# EAGLE design cc1200layoutv.2 (EAGLE 6.4)
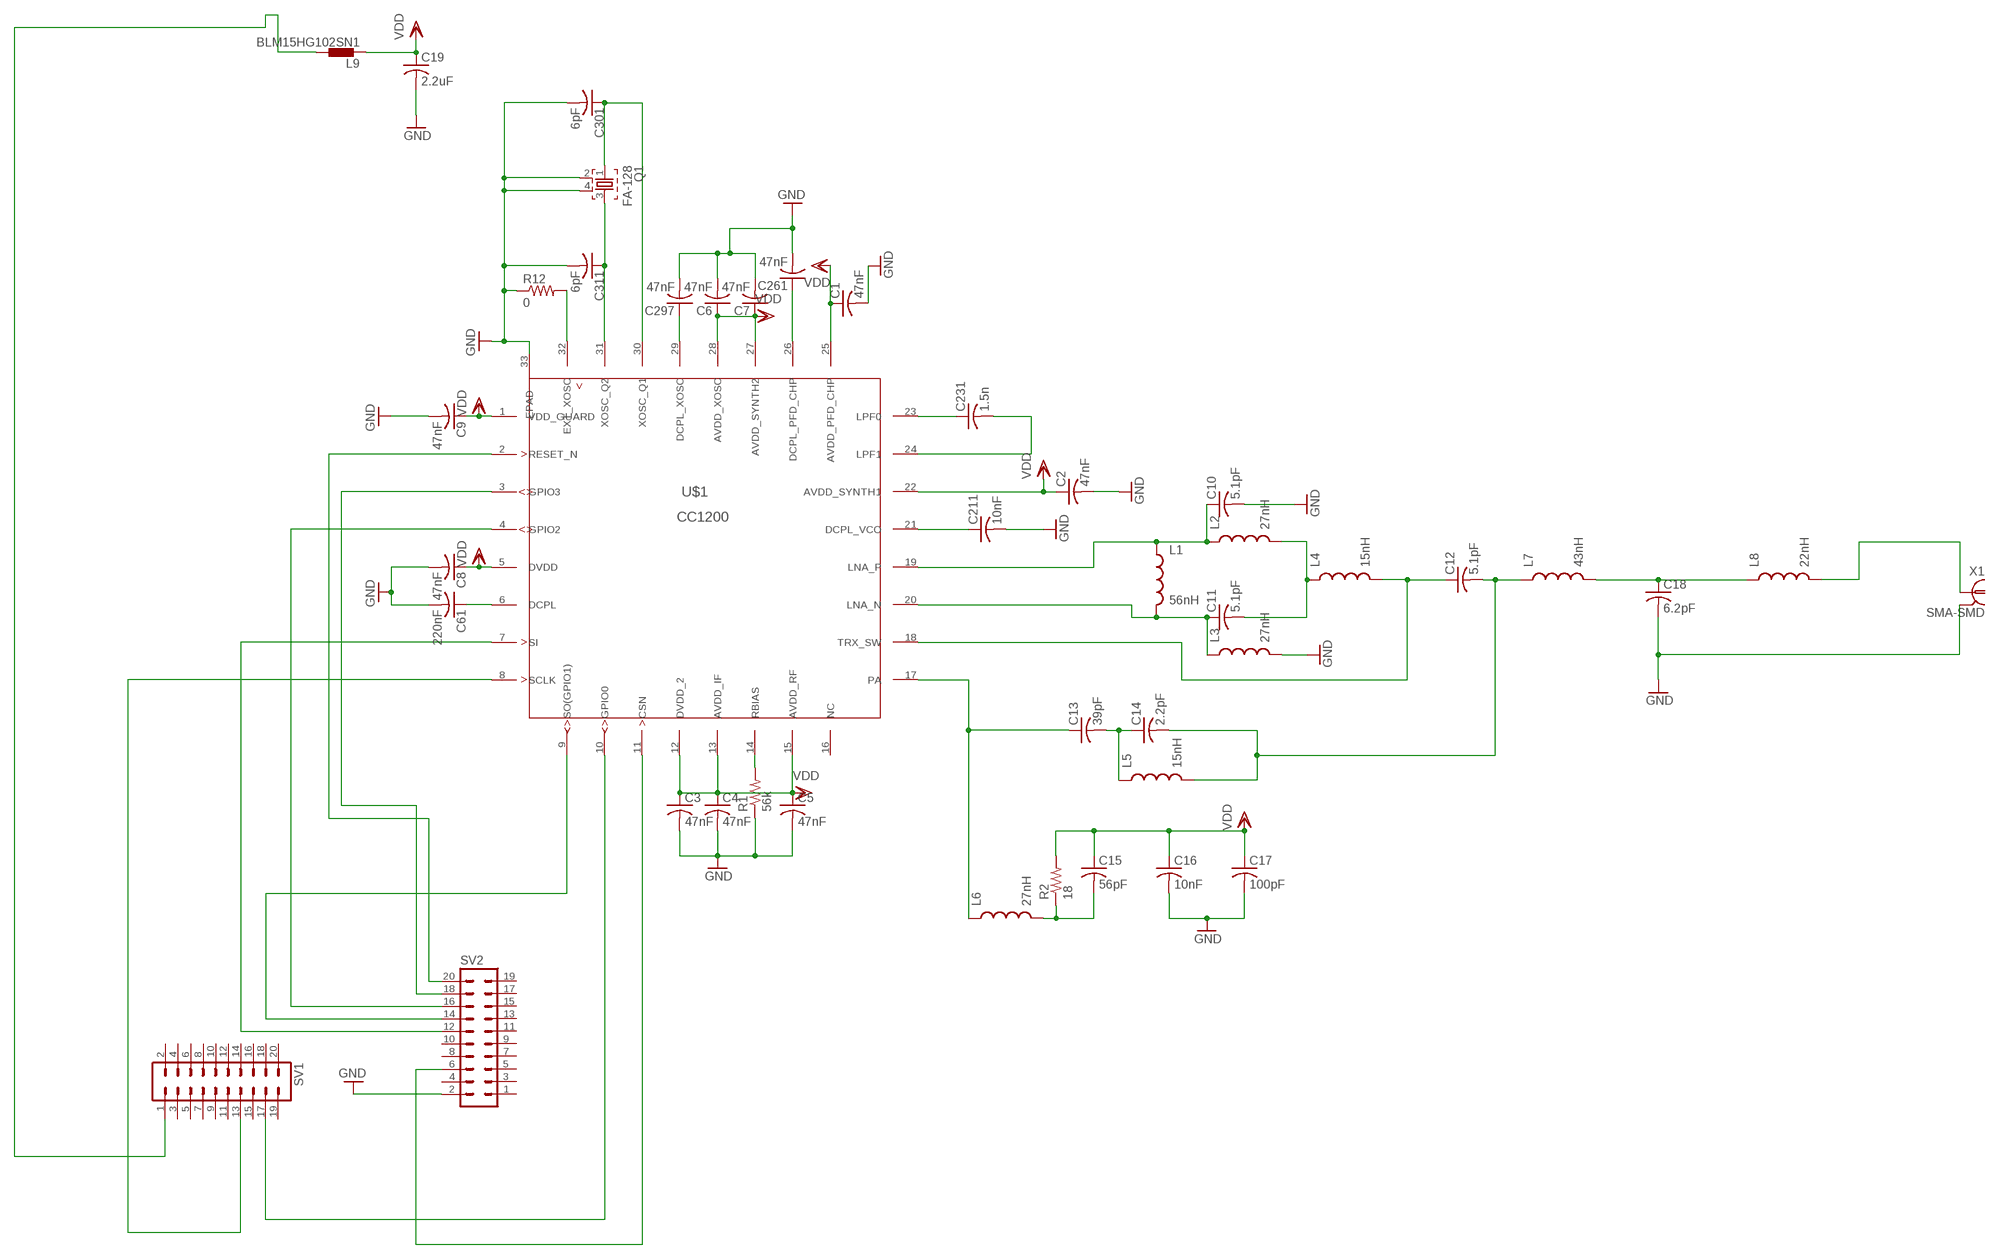
[diagram p0: schematic, sheet 1]

## Parts
C1  47nF  C-USC0402K  [C0402K]
C2  47nF  C-USC0402K  [C0402K]
C3  47nF  C-USC0402K  [C0402K]
C4  47nF  C-USC0402K  [C0402K]
C5  47nF  C-USC0402K  [C0402K]
C6  47nF  C-USC0402K  [C0402K]
C7  47nF  C-USC0402K  [C0402K]
C8  47nF  C-USC0402K  [C0402K]
C9  47nF  C-USC0402K  [C0402K]
C10  5.1pF  C-USC0402K  [C0402K]
C11  5.1pF  C-USC0402K  [C0402K]
C12  5.1pF  C-USC0402K  [C0402K]
C13  39pF  C-USC0402K  [C0402K]
C14  2.2pF  C-USC0402K  [C0402K]
C15  56pF  C-USC0402K  [C0402K]
C16  10nF  C-USC0402K  [C0402K]
C17  100pF  C-USC0402K  [C0402K]
C18  6.2pF  C-USC0402K  [C0402K]
C19  2.2uF  C-USC0603K  [C0603K]
C61  220nF  C-USC0402K  [C0402K]
C211  10nF  C-USC0402K  [C0402K]
C231  1.5n  C-USC0402K  [C0402K]
C261  47nF  C-USC0402K  [C0402K]
C297  47nF  C-USC0402K  [C0402K]
C301  6pF  C-USC0402K  [C0402K]
C311  6pF  C-USC0402K  [C0402K]
L1  56nH  INDUCTOR0402  [C0402]
L2  27nH  INDUCTOR0402  [C0402]
L3  27nH  INDUCTOR0402  [C0402]
L4  15nH  INDUCTOR0402  [C0402]
L5  15nH  INDUCTOR0402  [C0402]
L6  27nH  INDUCTOR0402  [C0402]
L7  43nH  INDUCTOR0402  [C0402]
L8  22nH  INDUCTOR0402  [C0402]
L9  BLM15HG102SN1  [0402]
Q1  FA-128  [FA-128]
R1  56k  R-US_R0402  [R0402]
R2  18  R-US_R0402  [R0402]
R12  0  R-US_R0402  [R0402]
SV1  MA10-2  [MA10-2]
SV2  MA10-2  [MA10-2]
U$1  CC1200  [RHB32_3P45X3P45]
X1  SMA-SMD  [SMA-SMD]

## Nets
GND: C1.2 C2.2 C3.2 C4.2 C5.2 C6.2 C7.2 C8.2 C9.2 C10.2 C16.2 C17.2 C18.2 C19.2 C61.2 C211.2 C261.2 C297.2 C301.2 C311.2 L3.2 Q1.2 Q1.4 R1.1 R12.1 SV2.2 U$1.33(EPAD) X1.2@1 X1.2@2 X1.2@3 X1.2@4 X1.2@5 X1.2@6
N$1: SV2.12 U$1.7(SI)
N$2: SV1.13 U$1.8(SCLK)
N$3: SV2.14 U$1.9(SO(GPIO1))
N$4: SV1.17 U$1.10(GPIO0)
N$5: SV2.6 U$1.11(CSN)
N$6: C231.1 U$1.23(LPF0)
N$7: C231.2 U$1.24(LPF1)
N$8: C211.1 U$1.21(DCPL_VCO)
N$9: C261.1 U$1.26(DCPL_PFD_CHP)
N$10: C297.1 U$1.29(DCPL_XOSC)
N$11: C61.1 U$1.6(DCPL)
N$12: R1.2 U$1.14(RBIAS)
N$13: R12.2 U$1.32(EXT_XOSC)
N$14: C311.1 Q1.3 U$1.31(XOSC_Q2)
N$15: SV2.16 U$1.4(GPIO2)
N$16: SV2.18 U$1.3(GPIO3)
N$17: SV2.20 U$1.2(RESET_N)
N$18: C301.1 Q1.1 U$1.30(XOSC_Q1)
N$19: C10.1 L1.1 L2.1 U$1.19(LNA_P)
N$20: C11.1 L1.2 L3.1 U$1.20(LNA_N)
N$21: L9.2 SV1.1
N$22: C13.1 L6.1 U$1.17(PA)
N$23: C11.2 L2.2 L4.1
N$24: C12.1 L4.2 U$1.18(TRX_SW)
N$25: C13.2 C14.1 L5.1
N$26: C12.2 C14.2 L5.2 L7.1
N$27: C15.2 L6.2 R2.1
N$31: C18.1 L7.2 L8.1
N$32: L8.2 X1.1
VDD: C1.1 C2.1 C3.1 C4.1 C5.1 C6.1 C7.1 C8.1 C9.1 C15.1 C16.1 C17.1 C19.1 L9.1 R2.2 U$1.1(VDD_GUARD) U$1.5(DVDD) U$1.12(DVDD_2) U$1.13(AVDD_IF) U$1.15(AVDD_RF) U$1.22(AVDD_SYNTH1) U$1.25(AVDD_PFD_CHP) U$1.27(AVDD_SYNTH2) U$1.28(AVDD_XOSC)
Unconnected: SV1.2 SV1.3 SV1.4 SV1.5 SV1.6 SV1.7 SV1.8 SV1.9 SV1.10 SV1.11 SV1.12 SV1.14 SV1.15 SV1.16 SV1.18 SV1.19 SV1.20 SV2.1 SV2.3 SV2.4 SV2.5 SV2.7 SV2.8 SV2.9 SV2.10 SV2.11 SV2.13 SV2.15 SV2.17 SV2.19 U$1.16(NC)

## Library data of the parts
C1-C19 C61 C211 C231 C261 C297 C301 C311 = resistor:C-US: CAPACITOR, American symbol
L1-L8 = SparkFun-Passives:INDUCTOR: Inductors Basic Inductor/Choke - 0603 and 1206. Footprints are not proven and vary greatly between part numbers. SRN6045- 33uH, 20% 1.4A SDR0403-560KL - 56uH, 10%, 500mA RMS/740mA peak
L9 = inductors:BLM15H: EMIFIL (R) Chip Ferrite Bead for GHz Noise Source: http://www.murata.com/ Ferrite Bead BLM15H.pdf
Q1 = crystal:FA-: MHz RANGE CRYSTAL UNIT Source: Epson Toyocom
R1 R2 R12 = resistor:R-US_: RESISTOR, American symbol
SV1 SV2 = con-lstb:MA10-2: PIN HEADER; OC_FARNELL: unknown; OC_NEWARK: unknown
U$1 = cc1200:CC1200
X1 = con-coax:SMA-SMD: SMA 50 Ohm Straight Jack Receptacle - Surface Mount www.johnsoncomponents.com Source: http://catalog.digikey.com .. 142-0711-201, 205, 202, 206.pdf; OC_FARNELL: unknown; OC_NEWARK: unknown

## Net classes
0 default: width 0.152 mm, drill 0.33 mm, clearance 0.152 mm

## Board
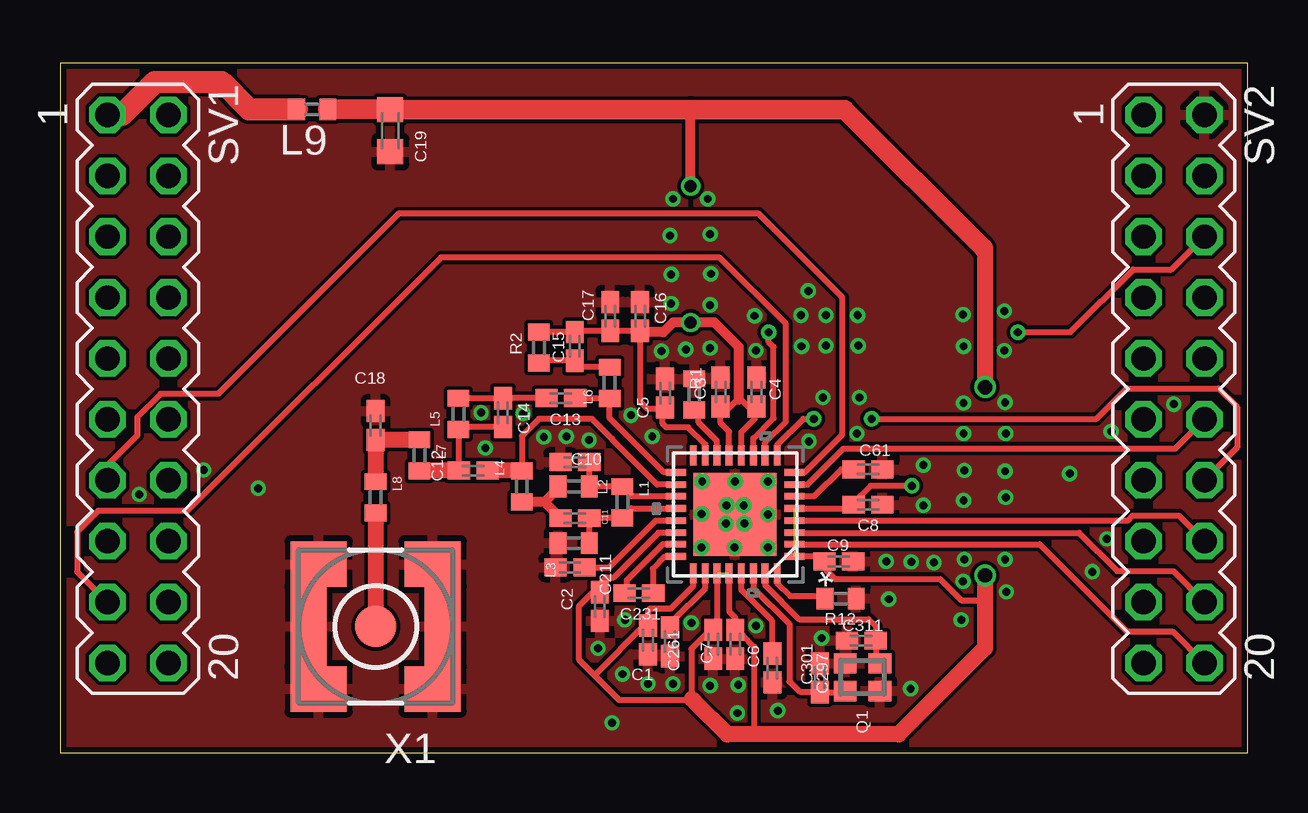
[diagram p1: board, top side]
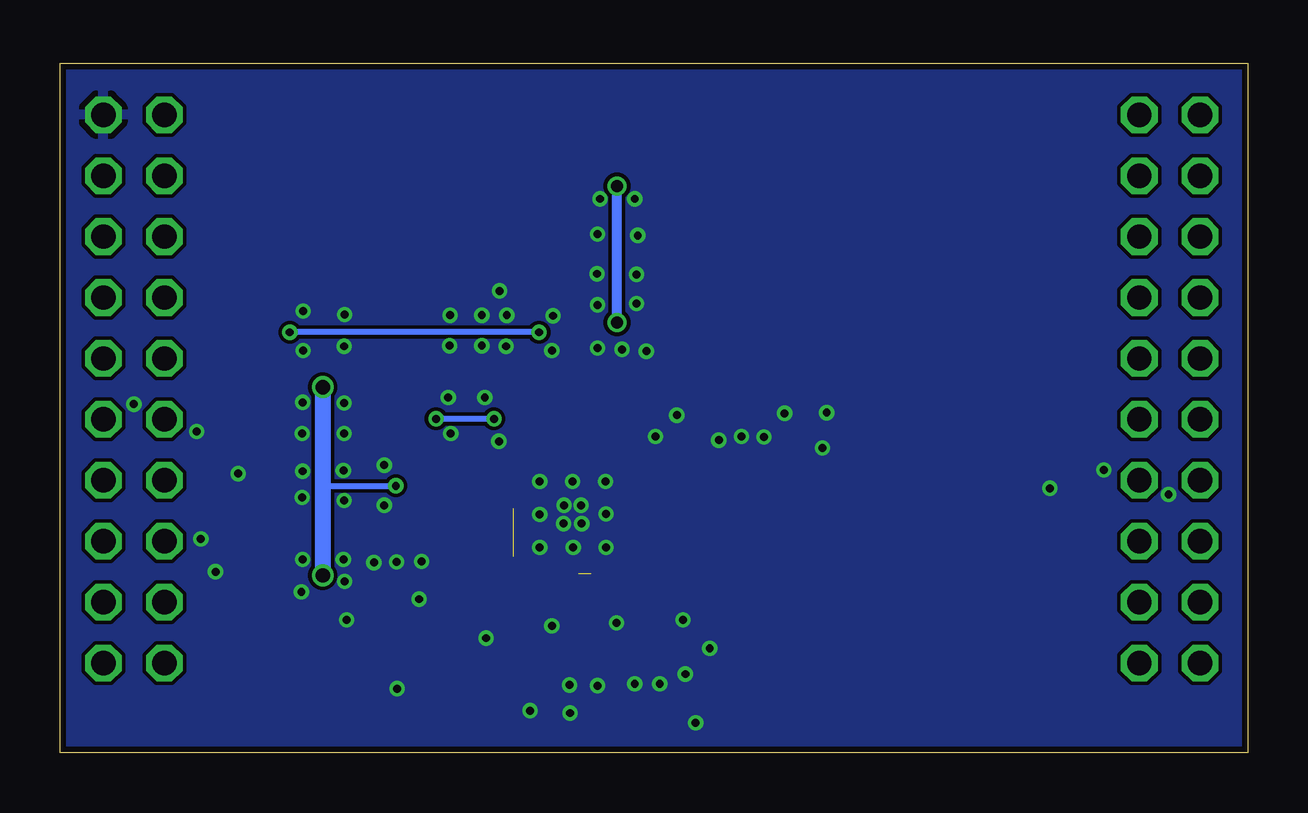
[diagram p2: board, bottom side, seen from below]

Size 49.51 x 28.75 mm. Coordinates in mm from the lower left corner, seen from the top.
Outline: 0,0 49.51,0 49.51,28.75 0,28.75 0,0
Copper layers (1*16): Top 0.035mm / dielectric 1.5mm / Bottom 0.035mm
Design rules "Elecrow_2-layer_eagle_rule": minimum track width 6mil, minimum drill 12mil, track to track 6mil, track to pad 6mil, pad to pad 6mil, via to via 6mil, smd to smd 0mil, copper to edge 10mil, drill to drill 10mil, minimum pad ring 10mil, minimum via ring 6mil, stop-mask expansion 2mil, vias tented up to drill 100mil, thermal gap 10mil

### Footprints (pad centres in the part's own frame; a part is rotated, then mirrored left to right if it is on the bottom)
C0402K = smd 0.925 x 0.74: 1 -0.6,0; 2 0.6,0
C0603K = smd 1.05 x 1.08: 1 -0.875,0; 2 0.875,0
C0402 = smd 0.7 x 0.9: 1 -0.65,0; 2 0.65,0
0402 = smd 0.7 x 0.9: 1 -0.65,0; 2 0.65,0
FA-128 = smd 0.95 x 0.85: 1 -0.725,-0.575; 2 0.725,-0.575; 3 0.725,0.575; 4 -0.725,0.575
R0402 = smd 0.7 x 0.9: 1 -0.65,0; 2 0.65,0
MA10-2 = drill 1.016 octagon: 1 -11.43,-1.27; 2 -11.43,1.27; 3 -8.89,-1.27; 4 -8.89,1.27; 5 -6.35,-1.27; 6 -6.35,1.27; 7 -3.81,-1.27; 8 -3.81,1.27; 9 -1.27,-1.27; 10 -1.27,1.27; 11 1.27,-1.27; 12 1.27,1.27; 13 3.81,-1.27; 14 3.81,1.27; 15 6.35,-1.27; 16 6.35,1.27; 17 8.89,-1.27; 18 8.89,1.27; 19 11.43,-1.27; 20 11.43,1.27
RHB32_3P45X3P45 = smd 0.838 x 0.279: 1 -2.464,1.753; 2 -2.464,1.245; 3 -2.464,0.762; 4 -2.464,0.254; 5 -2.464,-0.254; 6 -2.464,-0.762; 7 -2.464,-1.245; 8 -2.464,-1.753; 17 2.464,-1.753; 18 2.464,-1.245; 19 2.464,-0.762; 20 2.464,-0.254; 21 2.464,0.254; 22 2.464,0.762; 23 2.464,1.245; 24 2.464,1.753 | smd 0.279 x 0.838: 9 -1.753,-2.464; 10 -1.245,-2.464; 11 -0.762,-2.464; 12 -0.254,-2.464; 13 0.254,-2.464; 14 0.762,-2.464; 15 1.245,-2.464; 16 1.753,-2.464; 25 1.753,2.464; 26 1.245,2.464; 27 0.762,2.464; 28 0.254,2.464; 29 -0.254,2.464; 30 -0.762,2.464; 31 -1.245,2.464; 32 -1.753,2.464 | smd 3.454 x 3.454: 33 0,0
SMA-SMD = smd 1.73 x 1.73: 1 0,0 | smd 2.35 x 1.9: 2@1 -2.375,2.6; 2@2 -2.375,-2.6; 2@3 2.375,-2.6; 2@4 2.375,2.6 | smd 1.5 x 3.4: 2@5 -2.8,0; 2@6 2.8,0

### Placement (x,y rotation side)
C1  24.51,4.7 270 top
C2  22.5,6.1 270 top
C3  27.53,15.04 90 top
C4  29.03,15.04 90 top
C5  25.22,14.99 90 top
C6  28.14,4.52 270 top
C7  27.23,4.52 270 top
C8  33.68,10.34 0 top
C9  32.46,7.98 0 top
C10  21.46,12.12 180 top
C11  21.46,9.78 180 top
C12  17.22,11.76 180 top
C13  20.88,14.78 180 top
C14  18.47,14.17 270 top
C15  21.46,16.94 270 top
C16  24.18,18.19 90 top
C17  22.94,18.19 90 top
C18  13.16,13.64 90 top
C19  13.77,25.93 270 top
C61  33.68,11.81 0 top
C211  21.26,7.72 180 top
C231  24.13,6.65 0 top
C261  25.43,4.62 270 top
C297  29.69,3.53 270 top
C301  31.67,3.12 90 top
C311  33.4,4.67 180 top
L1  23.44,10.44 270 top
L2  21.41,11.1 180 top
L3  21.41,8.74 180 top
L4  19.25,11.1 90 top
L5  16.61,14.12 270 top
L6  22.91,15.42 90 top
L7  14.99,12.4 90 top
L8  13.16,10.64 270 top
L9  10.52,26.82 180 top
Q1  33.45,3.15 0 top
R1  26.44,14.94 270 top
R2  19.96,16.89 90 top
R12  32.54,6.43 180 top
SV1  3.25,15.16 270 top
SV2  46.43,15.16 270 top
U$1  28.14,9.93 180 top
X1  13.16,5.26 180 top

### Tracks (layer width: path | path; a pad name or v marks a point on that pad's centre or on a via)
GND  (via drill 0.33)
  other vias: 26.77,11.3 28.12,8.56 29.51,8.56 26.75,8.56 28.14,11.3 26.75,9.96 29.51,9.93 28.5,10.31 28.52,9.55 27.79,10.31 27.76,9.55 29.51,11.3 31.75,4.78 29.01,5.28 26.31,5.41 24.69,13.18 20.17,13.16 21.11,13.18 22.05,13.03 31.19,19.25 8.26,11.02 43.03,7.54 43.64,8.92 25.07,16.74 26.09,16.81 27.1,16.87 42.09,11.63 29.01,16.76 43.81,13.39 31.22,12.98 17.73,12.7 17.55,14.17 19.3,14.15 34.44,7.98 27.1,2.79 28.27,2.82 28.24,1.65 29.92,1.75 34.54,6.4 37.57,5.54 35.46,2.67 23.55,5.54 22.43,4.34 23.44,3.28 25.55,2.87 24.51,2.87 31.8,14.81 33.32,14.81 33.22,13.31 37.67,14.58 37.67,13.31 39.42,13.31 39.4,14.61 37.69,11.76 39.4,11.73 37.67,10.52 39.42,10.64 39.4,8.05 37.69,8.05 36.42,7.92 35.48,7.95 39.45,6.71 3.3,10.77 25.48,18.72 25.48,19.94 27.13,19.96 27.1,18.67 23.8,14.07 25.43,21.56 27.1,21.62 27,23.09 25.55,23.09 30.89,18.24 31.93,18.24 31.93,16.97 30.91,16.94 33.25,18.24 33.27,16.97 37.64,18.26 37.67,16.94 39.37,16.76 39.37,18.41 23.01,1.24 46.43,14.53 28.96,18.21 37.64,7.14 5.99,11.79 35.99,11.99 35.99,10.31
  pour Top: -2.54,55.85 54.61,55.85 54.61,-3.84 -2.54,-3.84
  pour Bottom: -3.81,59.66 55.88,59.66 55.88,-2.57 -3.81,-2.57
N$1
  Top 0.254: U$1.7 31.17,11.18 32.66,12.67 46.48,12.67 SV2.12
N$2
  Top 0.254: U$1.8 31.04,11.68 32.61,13.26 32.61,18.97 29.11,22.48 14.12,22.48 6.6,14.96 4.19,14.96 3.23,14 3.23,13.23 1.98,11.99 SV1.13
N$3  (via drill 0.33)
  Top 0.254: SV2.14 49.07,12.73 49.07,14.4 48.28,15.19 44.48,15.19 43.2,13.92 v33.83,13.92 | U$1.9 29.9,12.83 30.99,13.92 v31.42,13.92
  Bottom 0.254: v31.42,13.92 v33.83,13.92
N$4
  Top 0.254: U$1.10 29.39,12.93 30.25,13.79 30.25,17.88 27.48,20.65 15.88,20.65 5.31,10.08 1.6,10.08 0.71,9.19 0.71,7.54 SV1.17
N$5  (via drill 0.33)
  Top 0.254: U$1.11 28.91,13.11 29.74,13.94 29.74,16.92 29.54,17.12 v29.54,17.53 | v39.93,17.53 42.11,17.53 44.73,20.14 46.33,20.14 SV2.6
  Bottom 0.254: v29.54,17.53 v39.93,17.53
N$6
  Top 0.254: 23.55,6.7 C231.1 23.62,6.75 23.62,7.19 25.12,8.69 U$1.23
N$7
  Top 0.254: U$1.24 25.22,8.18 24.71,7.67 24.71,6.67 C231.2
N$8
  Top 0.254: C211.1 22.89,7.72 24.84,9.68 U$1.21
N$9
  Top 0.254: C261.1 25.53,5.49 26.9,6.86 U$1.26
N$10
  Top 0.254: U$1.29 28.4,6.78 29.67,5.51 29.67,4.16 C297.1
N$11
  Top 0.254: U$1.6 31.45,10.69 32.56,11.81 C61.1
N$12
  Top 0.254: U$1.14 27.38,13 26.62,13.77 26.62,14.11 R1.2
N$13
  Top 0.254: U$1.32 29.9,7.06 30.43,6.53 31.79,6.53 R12.2
N$14
  Top 0.254: Q1.3 34,3.9 C311.1 34.01,4.68 34.01,5.26 33.71,5.56 30.81,5.56 29.39,6.98 U$1.31
N$15
  Top 0.254: U$1.4 44.5,9.68 44.7,9.88 46.63,9.88 SV2.16
N$16
  Top 0.254: U$1.3 42.47,9.17 44.07,7.57 46.41,7.57 SV2.18
N$17
  Top 0.254: U$1.2 40.84,8.69 44.48,5.05 46.38,5.05 SV2.20
N$18
  Top 0.254: Q1.1 32.68,2.52 C301.1 31.66,2.54 30.84,2.54 30.4,2.97 30.4,5.36 28.91,6.86 U$1.30
N$19
  Top 0.254: U$1.19 23.82,10.69 L1.1 23.41,11.1 L2.1 C10.1
N$20
  Top 0.254: U$1.20 23.82,10.19 L1.2 23.41,9.78 C11.1 L3.1
N$21
  Top 0.914: SV1.1 2.59,26.59 3.96,27.97 6.73,27.97 7.87,26.82 L9.2
N$22
  Top 0.254: U$1.17 25.17,11.68 22.91,13.94 L6.1 22.9,14.78 C13.1
N$23
  Top 0.406: C11.2 20.19,10.45 | 20.19,10.45 L4.1 | 20.19,10.45 20.76,11.02 L2.2
N$24
  Top 0.254: U$1.18 24.89,11.18 23.01,13.06 23.01,13.08 22.17,13.92 19.96,13.92 19.25,13.21 L4.2
  Top 0.66: L4.2 C12.1
N$25
  Top 0.254: C13.2 C14.1 L5.1
N$26
  Top 0.254: C14.2 16.71,13.57 L5.2 C12.2
  Top 0.66: C12.2 16.64,11.74 | C12.2 15.01,11.77 L7.1
N$27
  Top 0.254: L6.2 21.74,16.07 C15.2 20.07,16.34 R2.1
N$31
  Top 0.66: L7.2 C18.1 L8.1
N$32
  Top 0.66: L8.2 X1.1
VDD  (via drill 0.33, 0.5, 0.6)  (2 unrouted)
  Top 0.254: U$1.25 26.39,6.93 25.45,5.99 24.59,5.99 24.51,5.92 C1.1 24.49,5.32 24.49,5.38 24.43,5.38 22.3,3.25 22.25,3.25 | 27.38,5.32 C7.1 | U$1.28 27.89,5.89 28.14,5.64 C6.1 28.25,5.02 28.25,4.9 28.45,4.9 28.93,4.42 28.93,0.81 | U$1.27 27.38,5.27 C7.1 | U$1.13 27.89,13.39 27.53,13.74 C3.1 27.64,14.33 27.84,14.33 28.22,14.71 28.3,14.71 28.4,14.71 28.78,14.33 28.92,14.33 C4.1 28.96,14.36 28.96,13.92 28.4,13.36 U$1.12 | U$1.15 26.9,12.85 26.19,13.56 25.27,13.56 25.12,13.72 25.12,14.28 C5.1 25.19,14.35 24.46,14.35 24.18,14.63 24.18,17.53 C16.1 C17.1 21.51,17.59 C15.1 R2.2 | U$1.22 24.94,9.17 23.09,7.32 22.76,7.32 22.5,7.06 C2.1 22.44,6.7 22.33,6.81 21.64,6.12 21.64,3.86 22.25,3.25 | U$1.5 32.93,10.19 C8.1 33.05,10.34 33.02,10.36 33.78,11.13 v35.51,11.13 | 26.34,2.24 26.31,2.26 26.31,4.32 26.92,4.93 27,4.93 27.19,5.12 C7.1 | U$1.1 31.66,8.18 C9.1 31.95,7.88 31.95,7.59 32.31,7.24 36.68,7.24 37.57,6.35 38.51,6.35 38.51,7.34 v38.56,7.39 | 22.25,3.25 23.32,2.18 26.39,2.18 26.43,2.15 | 38.48,21.03 38.56,20.95
  Top 0.406: 28.3,14.71 28.3,16.92 27.28,17.93 v26.29,17.93 25.55,17.93 25.15,17.53 24.18,17.53 | v26.29,23.62 26.29,26.81
  Top 0.66: 26.34,2.24 26.43,2.15 27.81,0.76 34.95,0.76 38.56,4.37 v38.56,7.39 | 38.56,21.03 38.56,20.95 v38.56,15.24
  Top 0.813: L9.1 13.73,26.82 C19.1 26.29,26.81 32.7,26.81 38.48,21.03
  Bottom 0.254: 38.61,11.13 v35.51,11.13
  Bottom 0.406: v26.29,17.93 v26.29,23.62
  Bottom 0.66: v38.56,15.24 v38.56,7.39